# EAGLE schematic Creaky-Capreolus.picked (EAGLE 7.0.0)

## Sheet 1 of 13
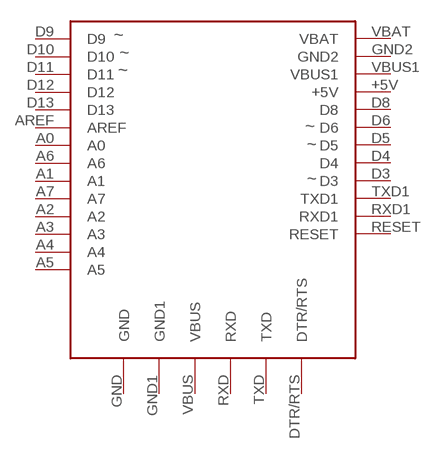
[diagram p0: schematic, sheet 1]

### Parts
U1_0_brain  ADAFRUIT-PRO-TRINKET-5V-BOB  [ADAFRUIT-PRO-TRINKET-5V]

### Nets
+5V_0_brain: U1_0_brain.+5V ; also sheet 3,6,9,12,13
A0_0_brain: U1_0_brain.A0 ; also sheet 10
A1_0_brain: U1_0_brain.A1 ; also sheet 13
A2_0_brain: U1_0_brain.A2 ; also sheet 13
A3_0_brain: U1_0_brain.A3 ; also sheet 13
A4_0_brain: U1_0_brain.A4 ; also sheet 3
A5_0_brain: U1_0_brain.A5 ; also sheet 3
A6_0_brain: U1_0_brain.A6
A7_0_brain: U1_0_brain.A7
AREF_0_brain: U1_0_brain.AREF
D3_0_brain: U1_0_brain.D3 ; also sheet 5
D4_0_brain: U1_0_brain.D4 ; also sheet 4
D5_0_brain: U1_0_brain.D5 ; also sheet 6
D6_0_brain: U1_0_brain.D6 ; also sheet 6
D8_0_brain: U1_0_brain.D8 ; also sheet 4
D9_0_brain: U1_0_brain.D9 ; also sheet 6
D10_0_brain: U1_0_brain.D10 ; also sheet 4
D11_0_brain: U1_0_brain.D11 ; also sheet 7
D12_0_brain: U1_0_brain.D12 ; also sheet 8
D13_0_brain: U1_0_brain.D13 ; also sheet 11
DTR/RTS_0_brain: U1_0_brain.DTR/RTS
GND_0_brain: U1_0_brain.GND U1_0_brain.GND1 U1_0_brain.GND2 ; also sheet 2,3,4,5,7,8,9,10,11,12,13
POS_1_battery: U1_0_brain.VBAT ; also sheet 2
RESET_0_brain: U1_0_brain.RESET
RXD1_0_brain: U1_0_brain.RXD1
RXD_0_brain: U1_0_brain.RXD
TXD1_0_brain: U1_0_brain.TXD1
TXD_0_brain: U1_0_brain.TXD
VBUS1_0_brain: U1_0_brain.VBUS1
VBUS_0_brain: U1_0_brain.VBUS

## Sheet 2 of 13
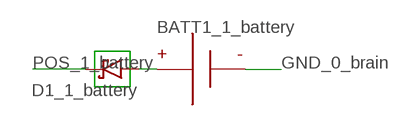
[diagram p1: schematic, sheet 2]

### Parts
BATT1_1_battery  BATTERY-9V-VERTICAL  [BATTERY_9V_KEYSTONE_968]
D1_1_battery  RESOLVED-DIODE-SCHOTTKY_TH-DO-41-AND-DO-204AL  [DIOAD1125W78L520D270_HS]

### Nets
GND_0_brain: BATT1_1_battery.N ; also sheet 1,3,4,5,7,8,9,10,11,12,13
N$1_1_battery: BATT1_1_battery.P D1_1_battery.A
POS_1_battery: D1_1_battery.C ; also sheet 1

## Sheet 3 of 13
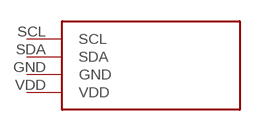
[diagram p2: schematic, sheet 3]

### Parts
u1_2_display  ADAFRUIT-7SEG-BACKPACK-RED  [ADAFRUIT-7SEG-BACKPACK]

### Nets
+5V_0_brain: u1_2_display.VDD ; also sheet 1,6,9,12,13
A4_0_brain: u1_2_display.SDA ; also sheet 1
A5_0_brain: u1_2_display.SCL ; also sheet 1
GND_0_brain: u1_2_display.GND ; also sheet 1,2,4,5,7,8,9,10,11,12,13

## Sheet 4 of 13
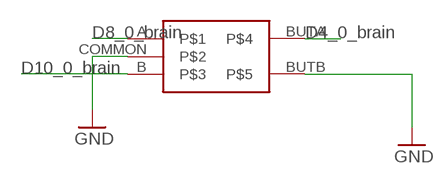
[diagram p3: schematic, sheet 4]

### Parts
U1_3_knob  ROTARY-ENCODER-W/BUTTON-ADAFRUIT377  [ROTARY-ENCODER-W/BUTTON-ADAFRUIT377]

### Nets
D4_0_brain: U1_3_knob.BUTA ; also sheet 1
D8_0_brain: U1_3_knob.A ; also sheet 1
D10_0_brain: U1_3_knob.B ; also sheet 1
GND_0_brain: U1_3_knob.BUTB U1_3_knob.COMMON ; supply symbol labelled GND ; also sheet 1,2,3,5,7,8,9,10,11,12,13

## Sheet 5 of 13
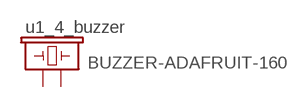
[diagram p4: schematic, sheet 5]

### Parts
u1_4_buzzer  BUZZER-ADAFRUIT-160  [BUZZER-12MM-ADAFRUIT-160]

### Nets
D3_0_brain: u1_4_buzzer.+ ; also sheet 1
GND_0_brain: u1_4_buzzer.- ; also sheet 1,2,3,4,7,8,9,10,11,12,13

## Sheet 6 of 13
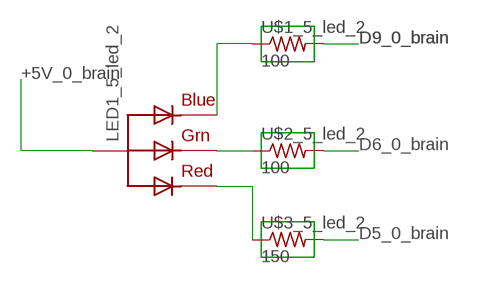
[diagram p5: schematic, sheet 6]

### Parts
LED1_5_led_2  RGBLED_CA-5MM  [LED5MMRGB]
U$1_5_led_2  100  RESOLVED-RESISTOR_TH-1/6W-CARBON  [RESAD770W45L370D210_HS]
U$2_5_led_2  100  RESOLVED-RESISTOR_TH-1/6W-CARBON  [RESAD770W45L370D210_HS]
U$3_5_led_2  150  RESOLVED-RESISTOR_TH-1/6W-CARBON  [RESAD770W45L370D210_HS]

### Nets
+5V_0_brain: LED1_5_led_2.2(VCC) ; also sheet 1,3,9,12,13
D5_0_brain: U$3_5_led_2.2 ; also sheet 1
D6_0_brain: U$2_5_led_2.2 ; also sheet 1
D9_0_brain: U$1_5_led_2.2 ; also sheet 1
N$1_5_led_2: LED1_5_led_2.4(BLUE) U$1_5_led_2.1
N$2_5_led_2: LED1_5_led_2.3(GREEN) U$2_5_led_2.1
N$3_5_led_2: LED1_5_led_2.1(RED) U$3_5_led_2.1

## Sheet 7 of 13
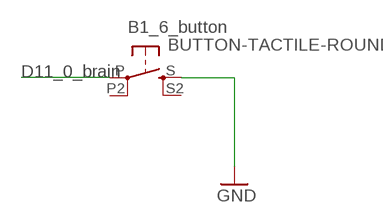
[diagram p6: schematic, sheet 7]

### Parts
B1_6_button  BUTTON-TACTILE-ROUND  [BUTTON-TACTILE-ROUND-ADAFRUIT1009]

### Nets
D11_0_brain: B1_6_button.P ; also sheet 1
GND_0_brain: B1_6_button.S ; supply symbol labelled GND ; also sheet 1,2,3,4,5,8,9,10,11,12,13
Unconnected: B1_6_button.P2(P1) B1_6_button.S2(S1)

## Sheet 8 of 13
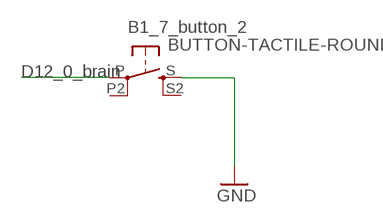
[diagram p7: schematic, sheet 8]

### Parts
B1_7_button_2  BUTTON-TACTILE-ROUND  [BUTTON-TACTILE-ROUND-ADAFRUIT1009]

### Nets
D12_0_brain: B1_7_button_2.P ; also sheet 1
GND_0_brain: B1_7_button_2.S ; supply symbol labelled GND ; also sheet 1,2,3,4,5,7,9,10,11,12,13
Unconnected: B1_7_button_2.P2(P1) B1_7_button_2.S2(S1)

## Sheet 9 of 13
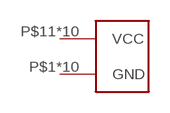
[diagram p8: schematic, sheet 9]

### Parts
u1_8_proto_area  PROTO-AREA-10X10  [PROTO-AREA-10X10]

### Nets
+5V_0_brain: u1_8_proto_area.P$11(VCC) u1_8_proto_area.P$12(VCC) u1_8_proto_area.P$13(VCC) u1_8_proto_area.P$14(VCC) u1_8_proto_area.P$15(VCC) u1_8_proto_area.P$16(VCC) u1_8_proto_area.P$17(VCC) u1_8_proto_area.P$18(VCC) u1_8_proto_area.P$19(VCC) u1_8_proto_area.P$20(VCC) ; also sheet 1,3,6,12,13
GND_0_brain: u1_8_proto_area.P$1(GND) u1_8_proto_area.P$2(GND) u1_8_proto_area.P$3(GND) u1_8_proto_area.P$4(GND) u1_8_proto_area.P$5(GND) u1_8_proto_area.P$6(GND) u1_8_proto_area.P$7(GND) u1_8_proto_area.P$8(GND) u1_8_proto_area.P$9(GND) u1_8_proto_area.P$10(GND) ; also sheet 1,2,3,4,5,7,8,10,11,12,13

## Sheet 10 of 13
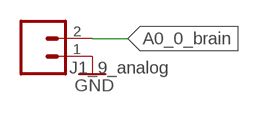
[diagram p9: schematic, sheet 10]

### Parts
J1_9_analog  HEADER-0.1IN-2POS-FEMALE  [HDRV2W63P254_2X1_508X254H838_HS]

### Nets
A0_0_brain: J1_9_analog.2 ; also sheet 1
GND_0_brain: J1_9_analog.1 ; supply symbol labelled GND ; also sheet 1,2,3,4,5,7,8,9,11,12,13

## Sheet 11 of 13
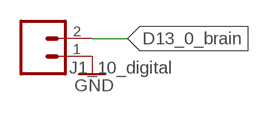
[diagram p10: schematic, sheet 11]

### Parts
J1_10_digital  HEADER-0.1IN-2POS-FEMALE  [HDRV2W63P254_2X1_508X254H838_HS]

### Nets
D13_0_brain: J1_10_digital.2 ; also sheet 1
GND_0_brain: J1_10_digital.1 ; supply symbol labelled GND ; also sheet 1,2,3,4,5,7,8,9,10,12,13

## Sheet 12 of 13
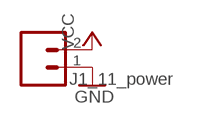
[diagram p11: schematic, sheet 12]

### Parts
J1_11_power  HEADER-0.1IN-2POS-FEMALE  [HDRV2W63P254_2X1_508X254H838_HS]

### Nets
+5V_0_brain: J1_11_power.2 ; supply symbol labelled VCC ; also sheet 1,3,6,9,13
GND_0_brain: J1_11_power.1 ; supply symbol labelled GND ; also sheet 1,2,3,4,5,7,8,9,10,11,13

## Sheet 13 of 13
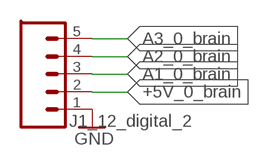
[diagram p12: schematic, sheet 13]

### Parts
J1_12_digital_2  HEADER-0.1IN-5POS-FEMALE  [HDRV5W63P254_5X1_1270X254H838_HS]

### Nets
+5V_0_brain: J1_12_digital_2.2 ; also sheet 1,3,6,9,12
A1_0_brain: J1_12_digital_2.3 ; also sheet 1
A2_0_brain: J1_12_digital_2.4 ; also sheet 1
A3_0_brain: J1_12_digital_2.5 ; also sheet 1
GND_0_brain: J1_12_digital_2.1 ; supply symbol labelled GND ; also sheet 1,2,3,4,5,7,8,9,10,11,12

## Library data of the parts
B1_6_button = Components:BUTTON-TACTILE; DIST: Adafruit; DISTPN: 1009; HIERARCHY_NAME: button.B1
B1_7_button_2 = Components:BUTTON-TACTILE; DIST: Adafruit; DISTPN: 1009; HIERARCHY_NAME: button_2.B1
BATT1_1_battery = Components:BATTERY; DIST: Digikey; DISTPN: 36-968-ND; HIERARCHY_NAME: battery.BATT1
D1_1_battery = KoalaBuild:RESOLVED-DIODE-SCHOTTKY_: Schottky diode; DATASHEET: http://www.st.com/web/en/resource/technical/document/datasheet/CD00001625.pdf; DATA_SHEET: http://www.st.com/web/en/resource/technical/document/datasheet/CD00001625.pdf; DB: /home/buildserver/gtron_devel/Gadgets/Tools/Koala/Koala/PartLibrary/Digikey/Schottky-Diodes-TH.csv; DEVICE: TH-DO-41-AND-DO-204AL; DIST: Digikey; DISTPN: 497-4547-1-ND; HIERARCHY_NAME: battery.D1; IMAGE: http://media.digikey.com/photos/STMicro%20Photos/1N5819.JPG; IRECT: 1A; MFR: STMicroelectronics; MIN_QTY: 1; MPN: 1N5817; PACKAGE: DIOAD1125W78L520D270_HS; PRICE: $0.57; SIZE: TH; STOCK: STOCK; VALUE: 450mV; VREV: 20V
J1_9_analog = Components:HEADER-0.1IN-2POS: 2 pin single inline pin header, socket, or connector; DIST: Digikey; DISTPN: S7000-ND; HIERARCHY_NAME: analog.J1; PIN1: GND; PIN2: A1
J1_10_digital = Components:HEADER-0.1IN-2POS: 2 pin single inline pin header, socket, or connector; DIST: Digikey; DISTPN: S7000-ND; HIERARCHY_NAME: digital.J1; PIN1: GND; PIN2: D1
J1_11_power = Components:HEADER-0.1IN-2POS: 2 pin single inline pin header, socket, or connector; DIST: Digikey; DISTPN: S7000-ND; HIERARCHY_NAME: power.J1; PIN1: GND; PIN2: VDD
J1_12_digital_2 = Components:HEADER-0.1IN-5POS: 5 pin single inline pin header, socket, or connector; DIST: Digikey; DISTPN: S6103-ND; HIERARCHY_NAME: digital_2.J1; PIN1: GND; PIN2: D1; PIN3: D2; PIN4: D3; PIN5: D4
LED1_5_led_2 = Components:RGBLED_CA: RGB LED, common-anode 5MM Staggered pins 5mm Piranha package http://www.ladyada.net/library/pcb/eaglelibrary.html; DIST: Adafruit; DISTPN: 302; HIERARCHY_NAME: led_2.LED1
U1_0_brain = BOBs:ADAFRUIT-PRO-TRINKET-5V: Adafruit Pro Trinket - 5V 16MHz; DIST: Adafruit; DISTPN: 2000; HIERARCHY_NAME: brain.U1
u1_2_display = BOBs:ADAFRUIT-7SEG-BACKPACK: Adafruit 0.56in 4-Digit 7-Segment Display w/I2C Backpack; DIST: Adafruit; DISTPN: 878; HIERARCHY_NAME: display.u1
U1_3_knob = Components:ROTARY-ENCODER-W/BUTTON-ADAFRUIT377; DIST: Adafruit; DISTPN: 377; HIERARCHY_NAME: knob.U1
u1_4_buzzer = Components:BUZZER: Buzzer 12mm Spark Fun Electronics SKU : Comp-Buzzer; DIST: Adafruit; DISTPN: 160; HIERARCHY_NAME: buzzer.u1
u1_8_proto_area = Components:PROTO-AREA; DIST: Gadgetron; DISTPN: proto-area-10x10; HIERARCHY_NAME: proto_area.u1
U$1_5_led_2 = KoalaBuild:RESOLVED-RESISTOR_: Resistor; CASE: TH; DATASHEET: http://www.yageo.com/NewPortal/yageodocoutput?fileName=/pdf/throughhole/Yageo_LR_CFR_2013.pdf; DATA_SHEET: http://www.yageo.com/NewPortal/yageodocoutput?fileName=/pdf/throughhole/Yageo_LR_CFR_2013.pdf; DB: /home/buildserver/gtron_devel/Gadgets/Tools/Koala/Koala/PartLibrary/Digikey/Resistors-TH.csv; DEVICE: TH-1/6W-CARBON; DIST: Digikey; DISTPN: 100EBK-ND; HIERARCHY_NAME: led_2.U$1; IMAGE: http://media.digikey.com/Renders/Yageo%20Renders/CFR-12JR-100R.jpg; MFR: Yageo; MIN_QTY: 1; MPN: CFR-12JB-52-100R; PACKAGE: RESAD770W45L370D210_HS; PRICE: $0.10; PWR: 167mW; SIZE: TH; STOCK: STOCK; TOL: 5%; VALUE_QUERY: 100
U$2_5_led_2 = KoalaBuild:RESOLVED-RESISTOR_: Resistor; CASE: TH; DATASHEET: http://www.yageo.com/NewPortal/yageodocoutput?fileName=/pdf/throughhole/Yageo_LR_CFR_2013.pdf; DATA_SHEET: http://www.yageo.com/NewPortal/yageodocoutput?fileName=/pdf/throughhole/Yageo_LR_CFR_2013.pdf; DB: /home/buildserver/gtron_devel/Gadgets/Tools/Koala/Koala/PartLibrary/Digikey/Resistors-TH.csv; DEVICE: TH-1/6W-CARBON; DIST: Digikey; DISTPN: 100EBK-ND; HIERARCHY_NAME: led_2.U$2; IMAGE: http://media.digikey.com/Renders/Yageo%20Renders/CFR-12JR-100R.jpg; MFR: Yageo; MIN_QTY: 1; MPN: CFR-12JB-52-100R; PACKAGE: RESAD770W45L370D210_HS; PRICE: $0.10; PWR: 167mW; SIZE: TH; STOCK: STOCK; TOL: 5%; VALUE_QUERY: 100
U$3_5_led_2 = KoalaBuild:RESOLVED-RESISTOR_: Resistor; CASE: TH; DATASHEET: http://www.yageo.com/NewPortal/yageodocoutput?fileName=/pdf/throughhole/Yageo_LR_CFR_2013.pdf; DATA_SHEET: http://www.yageo.com/NewPortal/yageodocoutput?fileName=/pdf/throughhole/Yageo_LR_CFR_2013.pdf; DB: /home/buildserver/gtron_devel/Gadgets/Tools/Koala/Koala/PartLibrary/Digikey/Resistors-TH.csv; DEVICE: TH-1/6W-CARBON; DIST: Digikey; DISTPN: 150EBK-ND; HIERARCHY_NAME: led_2.U$3; IMAGE: http://media.digikey.com/Renders/Yageo%20Renders/CFR-12JR-150R.jpg; MFR: Yageo; MIN_QTY: 1; MPN: CFR-12JB-52-150R; PACKAGE: RESAD770W45L370D210_HS; PRICE: $0.10; PWR: 167mW; SIZE: TH; STOCK: STOCK; TOL: 5%; VALUE_QUERY: 150